# Altium schematic sheet Isolation.SchDoc
size A4; SheetNumber: 10; SheetTotal: 11
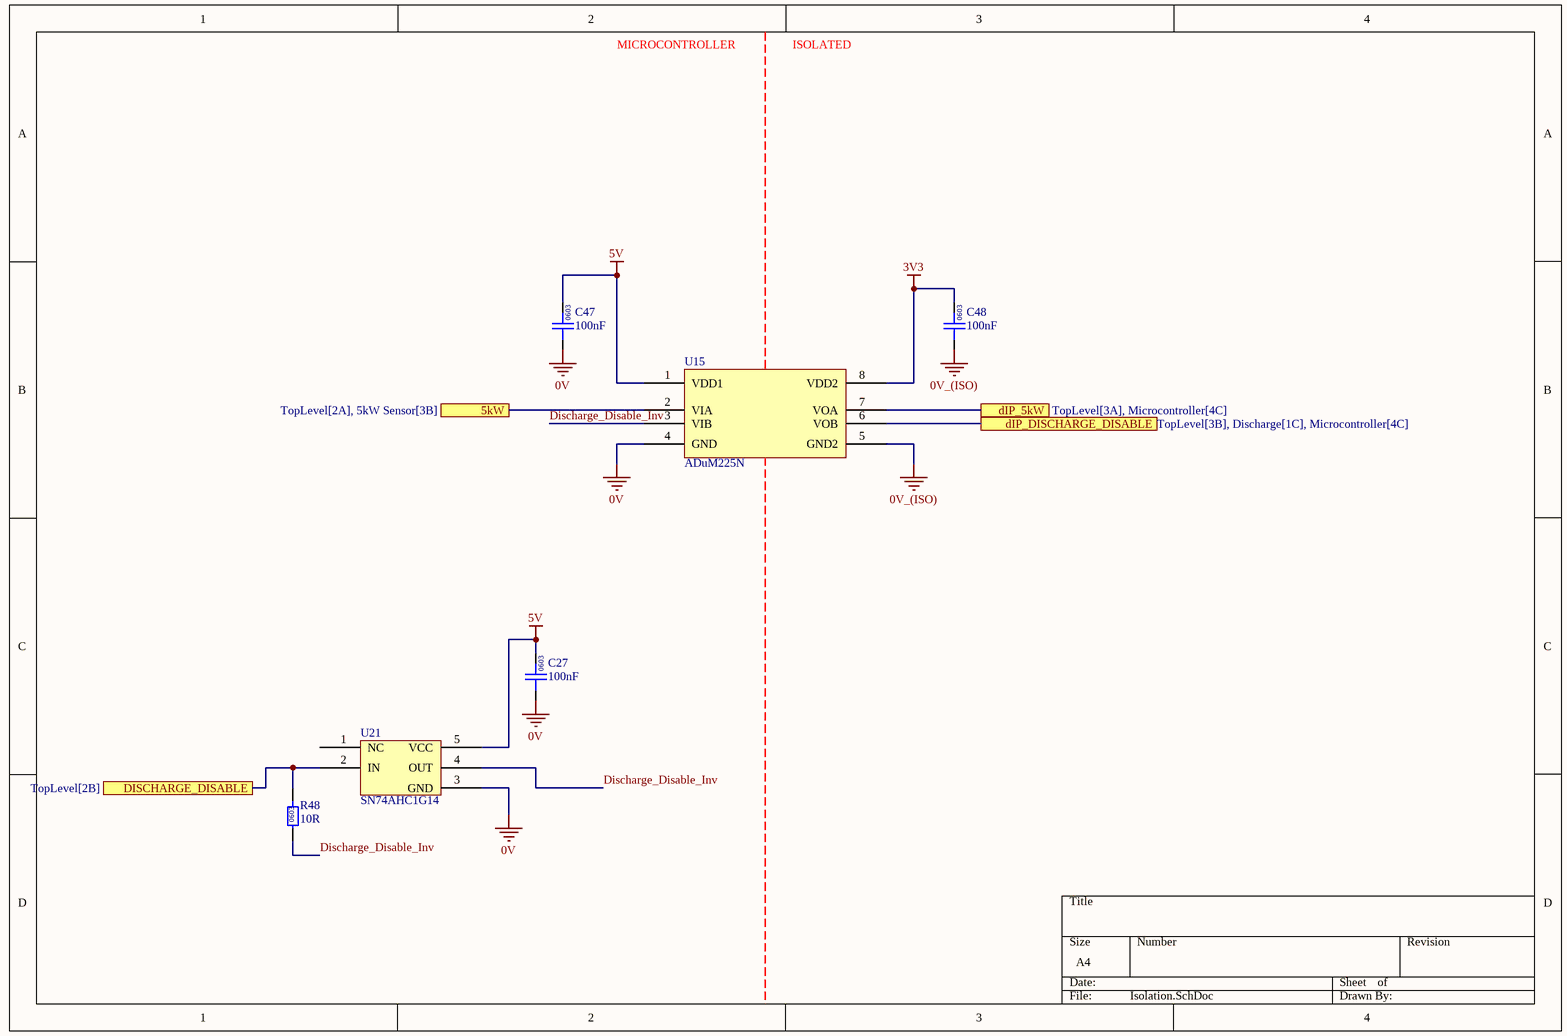
[diagram p0: Isolation.SchDoc]

## Parts
C27  100nF  [0603]
C47  100nF  [0603]
C48  100nF  [0603]
R48  10R  [0603]
U15  ADuM225N  [AD-SOIC-8W]
U21  SN74AHC1G14  [SOT23-5_TI]

## Ports
5kW (see TopLevel[2A], 5kW Sensor[3B]), dIP_5kW (see TopLevel[3A], Microcontroller[4C]), dIP_DISCHARGE_DISABLE (see TopLevel[3B], Discharge[1C], Microcontroller[4C]), DISCHARGE_DISABLE (see TopLevel[2B])

## Nets
0V: C27.1 C47.1 U15.4(GND) U21.3(GND)
0V_(ISO): C48.1 U15.5(GND2)
3V3: C48.2 U15.8(VDD2)
5V: C27.2 C47.2 U15.1(VDD1) U21.5(VCC)
5kW: U15.2(VIA) ; port 5kW
dIP_5kW: U15.7(VOA) ; port dIP_5kW
dIP_DISCHARGE_DISABLE: U15.6(VOB) ; port dIP_DISCHARGE_DISABLE
DISCHARGE_DISABLE: R48.2 U21.2(IN) ; port DISCHARGE_DISABLE
Discharge_Disable_Inv: R48.1 U15.3(VIB) U21.4(OUT)

Not connected (* = marked no-connect by the designer): U21 1(NC)

## Notes on the sheet
- MICROCONTROLLER
- ISOLATED
- (in symbol GCM188L81H104KA57D) 0603
- (in symbol RC0603FR-0710RL) 0603

## Library data of the parts
C27 C47 C48 = GCM188L81H104KA57D: Manufacturer: muRata; Rated Voltage: 50V; Tolerance: ±10%; Material: MLCC; Temperature Rating: X8L; Part Number: GCM188L81H104KA57D; Value: 100nF; Digikey Part Number: 490-6049-1-ND
R48 = RC0603FR-0710RL: Manufacturer: YAGEO; Tolerance: 0.01; Rated Power: 0.1W; Part Number: RC0603FR-0710RL; Value: 10R; Material: FR-07; Digikey Part Number: 311-10.0HRCT-ND
U15 = ADuM225N: DIGITAL ISOLATOR, DUAL CHANNEL; Manufacturer: Analogue Devices; Part Number: ADuM225N
U21 = SN74AHC1G14: IC INVERTER 1CH 1-INP SOT23-5; Manufacturer: Texas Instruments; Complex IC: 1; Part Number: SN74AHC1G14